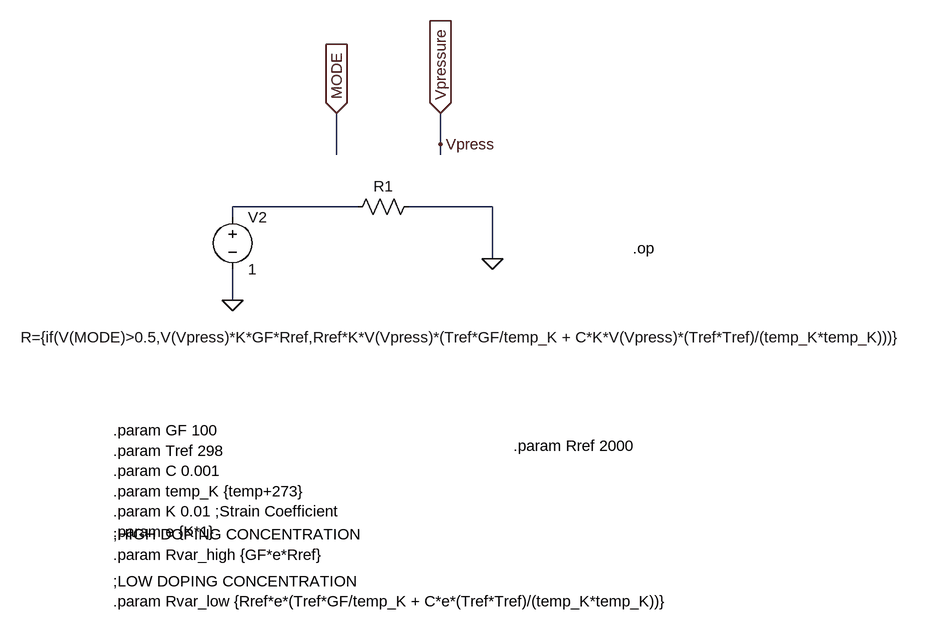
[diagram p0: schematic Draft4.asc]
Draft4.asc, the LTspice schematic file:
Version 4
SHEET 1 1204 1508
WIRE 464 240 464 192
WIRE 304 256 304 192
WIRE 464 256 464 240
WIRE 336 336 144 336
WIRE 544 336 416 336
WIRE 144 352 144 336
WIRE 544 416 544 336
WIRE 144 480 144 432
FLAG 464 192 Vpressure
IOPIN 464 192 In
FLAG 304 192 MODE
IOPIN 304 192 In
FLAG 464 240 Vpress
FLAG 144 480 0
FLAG 544 416 0
SYMBOL res 432 320 R90
WINDOW 0 0 56 VBottom 2
WINDOW 3 201 -69 VTop 2
SYMATTR InstName R1
SYMATTR Value R={if(V(MODE)>0.5,V(Vpress)*K*GF*Rref,Rref*K*V(Vpress)*(Tref*GF/temp_K + C*K*V(Vpress)*(Tref*Tref)/(temp_K*temp_K)))}
SYMBOL voltage 144 336 R0
SYMATTR InstName V2
SYMATTR Value 1
TEXT -40 680 Left 2 !.param GF 100\n.param Tref 298\n.param C 0.001\n.param temp_K {temp+273}\n.param K 0.01 ;Strain Coefficient\n.param e {K*1}
TEXT -40 912 Left 2 !;LOW DOPING CONCENTRATION\n.param Rvar_low {Rref*e*(Tref*GF/temp_K + C*e*(Tref*Tref)/(temp_K*temp_K))}
TEXT -40 840 Left 2 !;HIGH DOPING CONCENTRATION\n.param Rvar_high {GF*e*Rref}
TEXT 576 704 Left 2 !.param Rref 2000
TEXT 760 400 Left 2 !.op

The netlist it stands for:
* Draft4.asc
R1 0 N001 R={if(V(MODE)>0.5,V(Vpress)*K*GF*Rref,Rref*K*V(Vpress)*(Tref*GF/temp_K + C*K*V(Vpress)*(Tref*Tref)/(temp_K*temp_K)))}
V2 N001 0 1
.param GF 100
.param Tref 298
.param C 0.001
.param temp_K {temp+273}
.param K 0.01 ;Strain Coefficient
.param e {K*1}
;LOW DOPING CONCENTRATION
.param Rvar_low {Rref*e*(Tref*GF/temp_K + C*e*(Tref*Tref)/(temp_K*temp_K))}
;HIGH DOPING CONCENTRATION
.param Rvar_high {GF*e*Rref}
.param Rref 2000
.op
.backanno
.end